# Altium schematic sheet 03-ETHERNET.SchDoc
size C
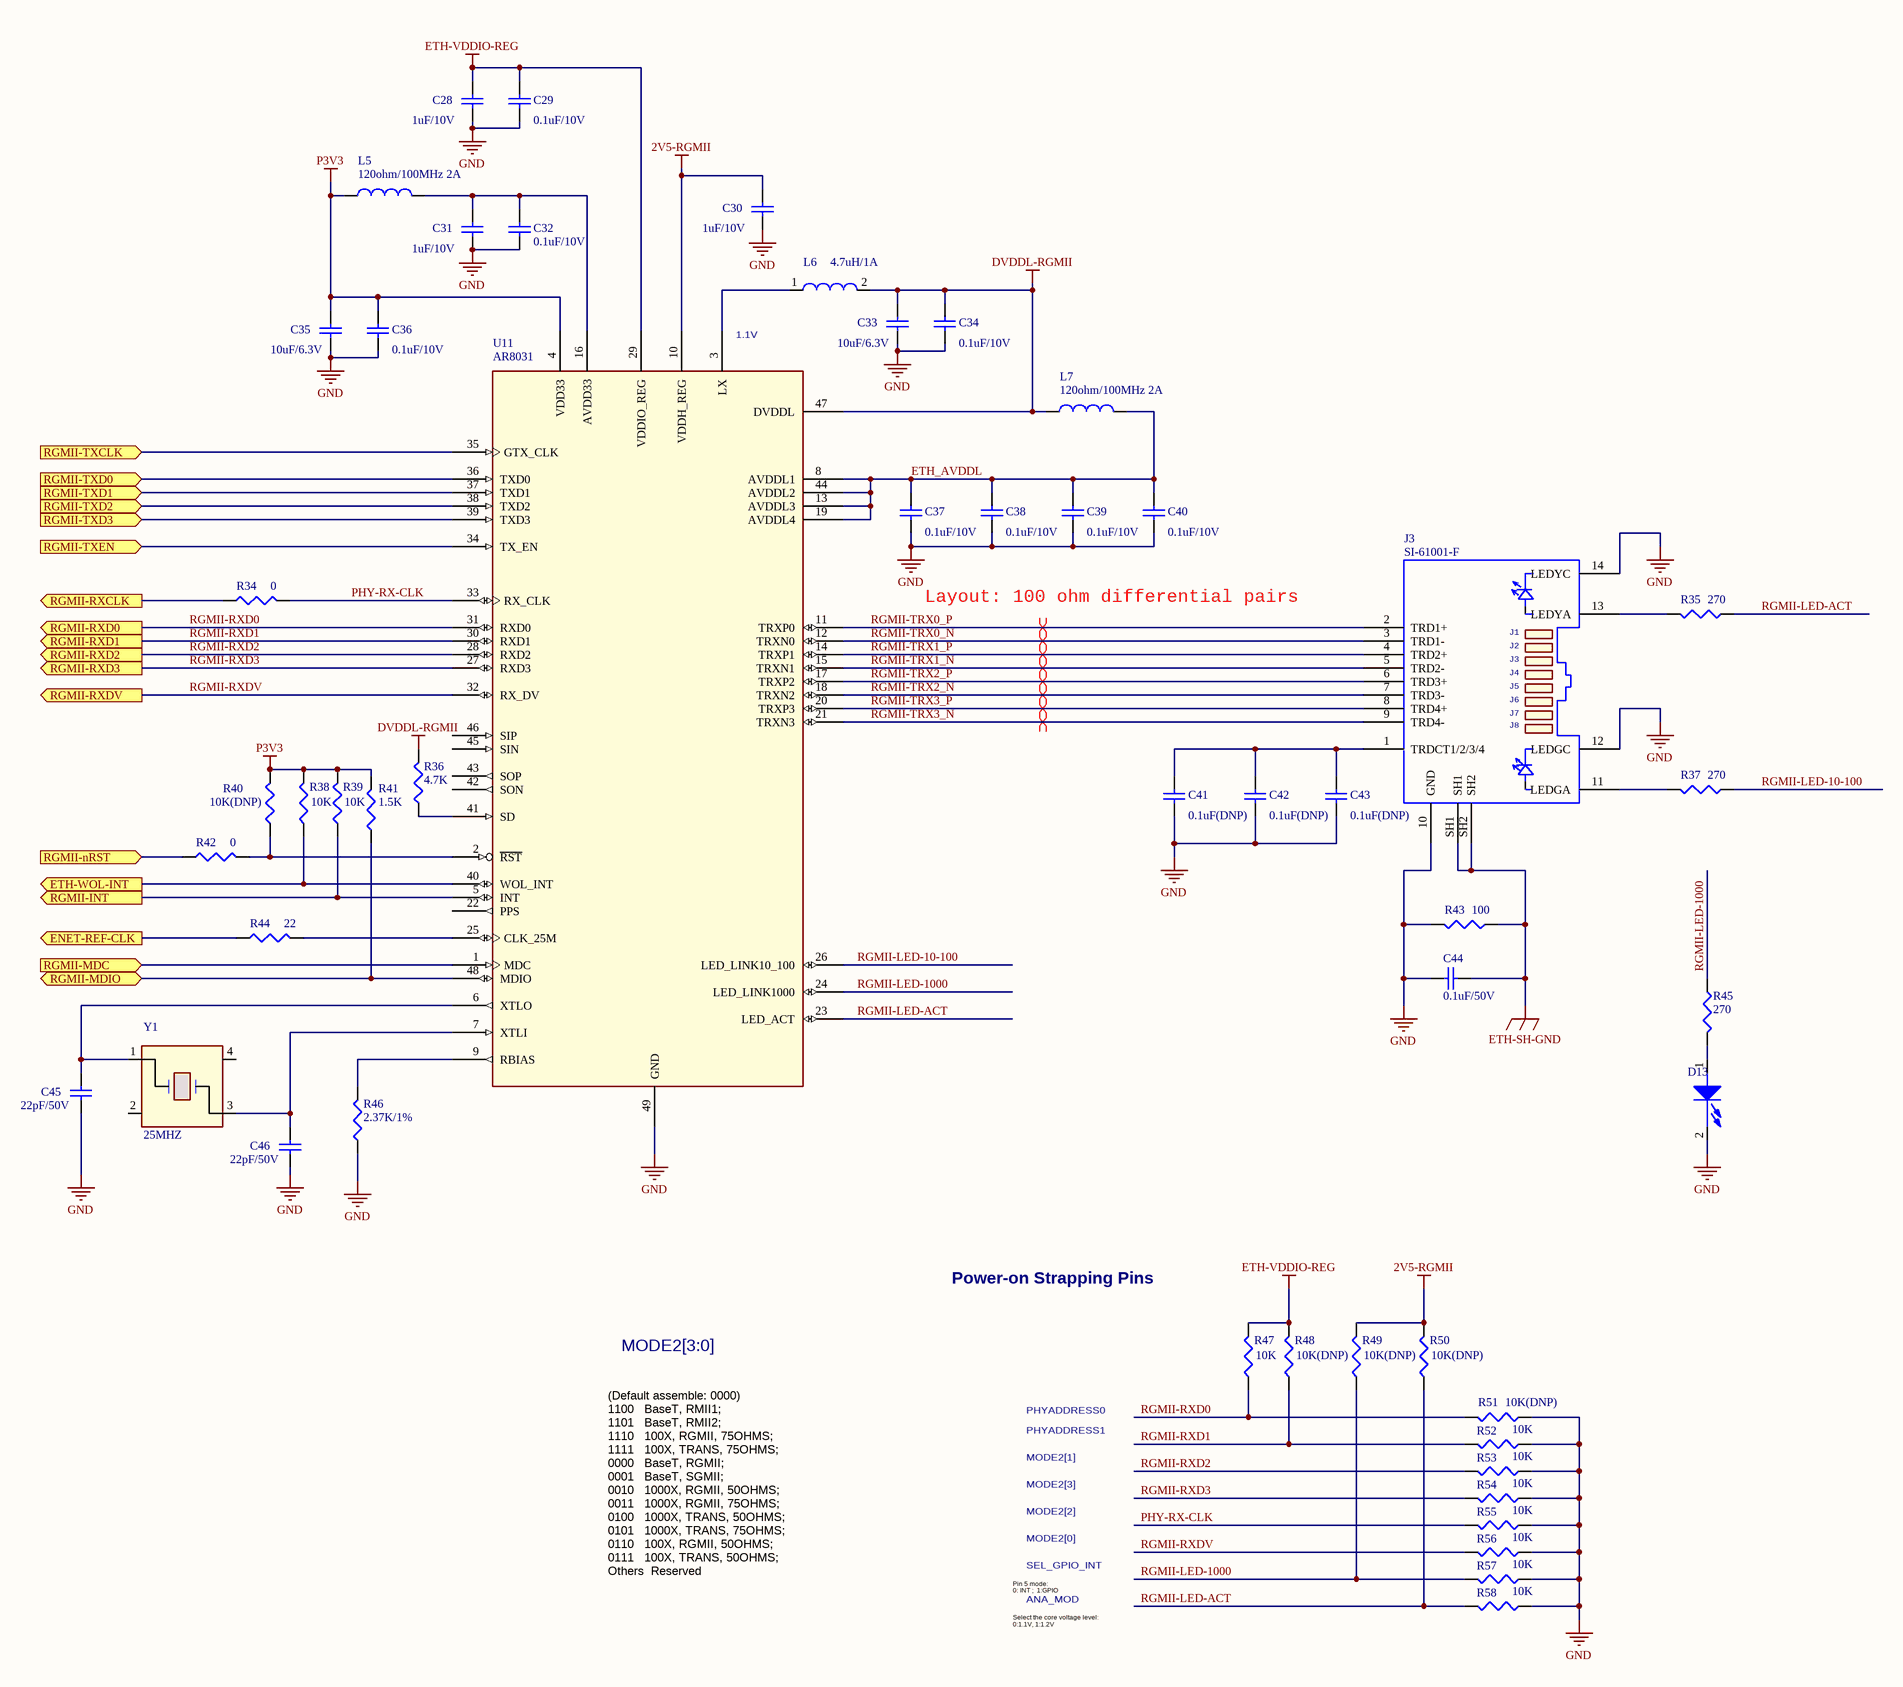
[diagram p0: 03-ETHERNET.SchDoc]

## Parts
C28  1uF/10V  [0402]
C29  0.1uF/10V  [0402]
C30  1uF/10V  [0402]
C31  1uF/10V  [0402]
C32  0.1uF/10V  [0402]
C33  10uF/6.3V  [0805]
C34  0.1uF/10V  [0402]
C35  10uF/6.3V  [0805]
C36  0.1uF/10V  [0402]
C37  0.1uF/10V  [0402]
C38  0.1uF/10V  [0402]
C39  0.1uF/10V  [0402]
C40  0.1uF/10V  [0402]
C41  0.1uF(DNP)  [0603]
C42  0.1uF(DNP)  [0603]
C43  0.1uF(DNP)  [0603]
C44  0.1uF/50V  [0603]
C45  22pF/50V  [0402]
C46  22pF/50V  [0402]
D13  LED GREEN  [LED0603]  (value not drawn)
J3  SI-61001-F  [SI-61001]
L5  120ohm/100MHz 2A  [0603]
L6  4.7uH/1A  [IND-4.7UH-1A]
L7  120ohm/100MHz 2A  [0603]
R34  0  [0402]
R35  270  [0402]
R36  4.7K  [0402]
R37  270  [0402]
R38  10K  [0402]
R39  10K  [0402]
R40  10K(DNP)  [0402]
R41  1.5K  [0402]
R42  0  [0402]
R43  100  [0402]
R44  22  [0402]
R45  270  [0402]
R46  2.37K/1%  [0402]
R47  10K  [0402]
R48  10K(DNP)  [0402]
R49  10K(DNP)  [0402]
R50  10K(DNP)  [0402]
R51  10K(DNP)  [0402]
R52  10K  [0402]
R53  10K  [0402]
R54  10K  [0402]
R55  10K  [0402]
R56  10K  [0402]
R57  10K  [0402]
R58  10K  [0402]
U11  AR8031  [QFN48]
Y1  25MHZ  [XTAL4_SX_3225]

## Ports
ENET-REF-CLK (out), ETH-WOL-INT (out), RGMII-INT (out), RGMII-MDC (in), RGMII-MDIO (bidir), RGMII-nRST (in), RGMII-RXCLK (out), RGMII-RXD0 (out), RGMII-RXD1 (out), RGMII-RXD2 (out), RGMII-RXD3 (out), RGMII-RXDV (out), RGMII-TXCLK (in), RGMII-TXD0 (in), RGMII-TXD1 (in), RGMII-TXD2 (in), RGMII-TXD3 (in), RGMII-TXEN (in)

## Nets
2V5-RGMII: C30.1 R49.2 R50.2 U11.10(VDDH_REG)
DVDDL-RGMII: C33.1 C34.1 L6.2 L7.1 R36.2 U11.47(DVDDL)
ETH-SH-GND: C44.2 J3.SH1 J3.SH2 R43.1
ETH-VDDIO-REG: C28.1 C29.1 R47.2 R48.2 U11.29(VDDIO_REG)
GND: C28.2 C29.2 C30.2 C31.2 C32.2 C33.2 C34.2 C35.2 C36.2 C37.2 C38.2 C39.2 C40.2 C41.2 C42.2 C43.2 C44.1 C45.2 C46.2 D13.2(CATHODE) J3.10(GND) J3.12(LEDGC) J3.14(LEDYC) R43.2 R46.1 R51.1 R52.1 R53.1 R54.1 R55.1 R56.1 R57.1 R58.1 U11.49(GND)
P3V3: C35.1 C36.1 L5.1 R38.2 R39.2 R40.2 R41.2 U11.4(VDD33)
ENET-REF-CLK: R44.1 ; port ENET-REF-CLK
ETH-WOL-INT: R38.1 U11.40(WOL_INT) ; port ETH-WOL-INT
ETH_AVDDL: C37.1 C38.1 C39.1 C40.1 L7.2 U11.8(AVDDL1) U11.13(AVDDL3) U11.19(AVDDL4) U11.44(AVDDL2)
PHY-RX-CLK: R34.2 R55.2 U11.33(RX_CLK)
RGMII-INT: R39.1 U11.5(INT) ; port RGMII-INT
RGMII-LED-10-100: R37.1 U11.26(LED_LINK10_100)
RGMII-LED-1000: R45.1 R49.1 R57.2 U11.24(LED_LINK1000)
RGMII-LED-ACT: R35.1 R50.1 R58.2 U11.23(LED_ACT)
RGMII-MDC: U11.1(MDC) ; port RGMII-MDC
RGMII-MDIO: R41.1 U11.48(MDIO) ; port RGMII-MDIO
RGMII-nRST: R42.1 ; port RGMII-nRST
RGMII-RXCLK: R34.1 ; port RGMII-RXCLK
RGMII-RXD0: R47.1 R51.2 U11.31(RXD0) ; port RGMII-RXD0
RGMII-RXD1: R48.1 R52.2 U11.30(RXD1) ; port RGMII-RXD1
RGMII-RXD2: R53.2 U11.28(RXD2) ; port RGMII-RXD2
RGMII-RXD3: R54.2 U11.27(RXD3) ; port RGMII-RXD3
RGMII-RXDV: R56.2 U11.32(RX_DV) ; port RGMII-RXDV
RGMII-TRX0_N: J3.3(TRD1-) U11.12(TRXN0)
RGMII-TRX0_P: J3.2(TRD1+) U11.11(TRXP0)
RGMII-TRX1_N: J3.5(TRD2-) U11.15(TRXN1)
RGMII-TRX1_P: J3.4(TRD2+) U11.14(TRXP1)
RGMII-TRX2_N: J3.7(TRD3-) U11.18(TRXN2)
RGMII-TRX2_P: J3.6(TRD3+) U11.17(TRXP2)
RGMII-TRX3_N: J3.9(TRD4-) U11.21(TRXN3)
RGMII-TRX3_P: J3.8(TRD4+) U11.20(TRXP3)
RGMII-TXCLK: U11.35(GTX_CLK) ; port RGMII-TXCLK
RGMII-TXD0: U11.36(TXD0) ; port RGMII-TXD0
RGMII-TXD1: U11.37(TXD1) ; port RGMII-TXD1
RGMII-TXD2: U11.38(TXD2) ; port RGMII-TXD2
RGMII-TXD3: U11.39(TXD3) ; port RGMII-TXD3
RGMII-TXEN: U11.34(TX_EN) ; port RGMII-TXEN
NetC31_1: C31.1 C32.1 L5.2 U11.16(AVDD33)
NetC41_1: C41.1 C42.1 C43.1 J3.1(TRDCT1/2/3/4)
NetC45_1: C45.1 U11.6(XTLO) Y1.1
NetC46_1: C46.1 U11.7(XTLI) Y1.3
NetD13_1: D13.1(ANODE) R45.2
NetJ3_11: J3.11(LEDGA) R37.2
NetJ3_13: J3.13(LEDYA) R35.2
NetL6_1: L6.1 U11.3(LX)
NetR36_1: R36.1 U11.41(SD)
NetR40_1: R40.1 R42.2 U11.2(~{RST})
NetR44_2: R44.2 U11.25(CLK_25M)
NetR46_2: R46.2 U11.9(RBIAS)

Not connected (* = marked no-connect by the designer): U11 22(PPS) 42(SON) 43(SOP) 45(SIN) 46(SIP); Y1 2 4

## Layout directives
differential pair: RGMII-TRX0_N, RGMII-TRX0_P, RGMII-TRX1_N, RGMII-TRX1_P, RGMII-TRX2_N, RGMII-TRX2_P, RGMII-TRX3_N, RGMII-TRX3_P

## Notes on the sheet
- (near U11) 1.1V
- Layout: 100 ohm differential pairs
- Power-on Strapping Pins
- MODE2[3:0]
- PHYADDRESS0
- PHYADDRESS1
- MODE2[2]
- MODE2[3]
- MODE2[1]
- SEL_GPIO_INT
- MODE2[0]
- (Default assemble: 0000)
  1100   BaseT, RMII1;
  1101   BaseT, RMII2;
  1110   100X, RGMII, 75OHMS;
  1111   100X, TRANS, 75OHMS;
  0000   BaseT, RGMII;
  0001   BaseT, SGMII;
  0010   1000X, RGMII, 50OHMS;
  0011   1000X, RGMII, 75OHMS;
  0100   1000X, TRANS, 50OHMS;
  0101   1000X, TRANS, 75OHMS;
  0110   100X, RGMII, 50OHMS;
  0111   100X, TRANS, 50OHMS;
  Others  Reserved
- Pin 5 mode:
  0: INT ;  1:GPIO
- Select the core voltage level:
  0:1.1V, 1:1.2V
- ANA_MOD
- (in symbol SI-61001-F) J1; J2; J4; J5; J6; J7; J8

## Library data of the parts
C28-C46 = Cap: Capacitor; Published: 8-Jun-2000; LatestRevisionDate: 17-Jul-2002; LatestRevisionNote: Re-released for DXP Platform.; PackageReference: RAD-0.3; Publisher: Altium Limited; PackageDescription: Radial Cap, Thru-Hole; 2 Leads; 0.3 in Pin Spacing
D13 = LN01401_1
J3 = SI-61001-F: CLASS: IO
L5 L7 = Inductor: Code_IEC: 1005; Value: 300ohm/100MHz BEAD; Published: 8-Jun-2000; LatestRevisionDate: 29-May-2009; LatestRevisionNote: IPC-7351 Footprint Added.; PackageReference: 0402-A; Publisher: Altium Limited; PackageDescription: Chip Inductor; Code_JEITA: 0402
L6 = INDUCTOR: IND PWR 4.7UH@1MHZ 1A 20% SMD; PART_TYPE: INDUCTOR\POWER; CLASS: DISCRETE; SIGNAL_MODEL: DEFAULT_INDUCTOR_4700nH_2_1; PRIORITY_PN: 024-00152; CAD_APPROVED: Yes; MFG_PN01: VLS3012T-4R7M1R0; MFG_NAME01: TDK; AGILE_PN: 180-77706; ROOM: RGMII_PHY; HEIGHT: 1.2MM; ROHS: Yes; Tolerance: 20%
R34-R58 = CR16-1003FM
U11 = AR8031_QFN48: IC XCVR ETHERNET PHY 10/100/1000G-BIT 3.3V QFN48; AGILE_PN: 312-80115; MFG_NAME01: QUALCOMM ATHEROS, INC; MFG_PN01: AR8031-AL1A; CAD_APPROVED: Yes; CLASS: IC; ROHS: Yes; HEIGHT: 0.8MM
Y1 = XTAL_13Y: XTAL 25MHZ -- -- SMT; CLASS: IC; AGILE_PN: 230-77853; MFG_NAME01: ABRACON CORP; MFG_PN01: ABMM-25.000MHZ-B2-T; CAD_APPROVED: Yes; ROHS: Yes; HEIGHT: 1.3MM